# EAGLE design Stick IMUinator v1.3 (EAGLE 6.2)
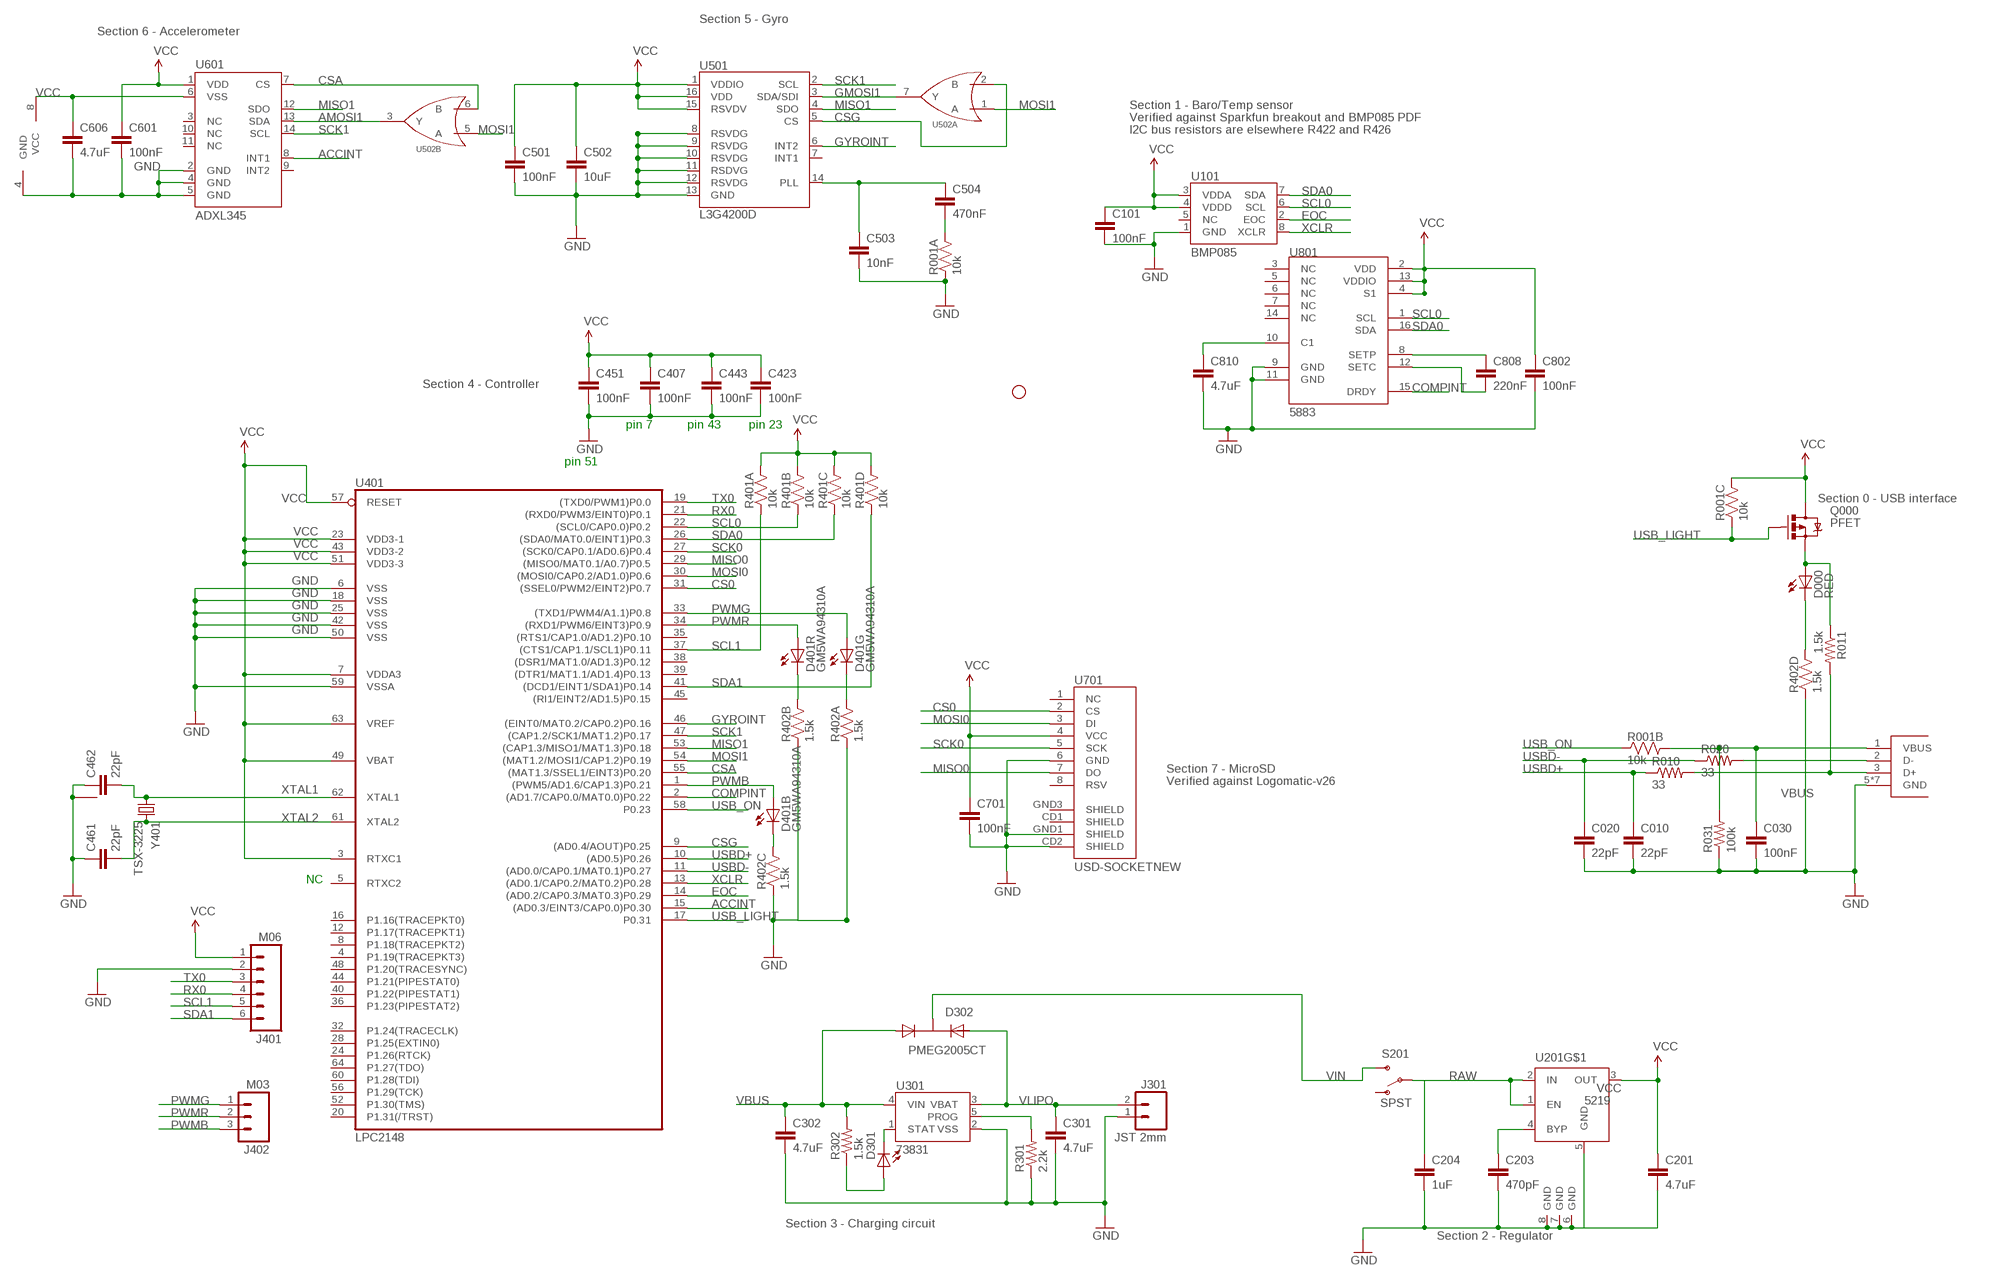
[diagram p0: schematic, sheet 1]

## Parts
C010  22pF  CAP0402-CAP  [0402-CAP]
C020  22pF  CAP0402-CAP  [0402-CAP]
C030  100nF  CAP0402-CAP  [0402-CAP]
C101  100nF  CAP0402-CAP  [0402-CAP]
C201  4.7uF  CAP0402-CAP  [0402-CAP]
C203  470pF  CAP0402-CAP  [0402-CAP]
C204  1uF  CAP0402-CAP  [0402-CAP]
C301  4.7uF  CAP0402-CAP  [0402-CAP]
C302  4.7uF  CAP0402-CAP  [0402-CAP]
C407  100nF  CAP0402-CAP  [0402-CAP]
C423  100nF  CAP0402-CAP  [0402-CAP]
C443  100nF  CAP0402-CAP  [0402-CAP]
C451  100nF  CAP0402-CAP  [0402-CAP]
C461  22pF  CAP0402-CAP  [0402-CAP]
C462  22pF  CAP0402-CAP  [0402-CAP]
C501  100nF  CAP0402-CAP  [0402-CAP]
C502  10uF  CAP0603-CAP  [0603-CAP]
C503  10nF  CAP0402-CAP  [0402-CAP]
C504  470nF  CAP0402-CAP  [0402-CAP]
C601  100nF  CAP0402-CAP  [0402-CAP]
C606  4.7uF  CAP0402-CAP  [0402-CAP]
C701  100nF  CAP0402-CAP  [0402-CAP]
C802  100nF  CAP0402-CAP  [0402-CAP]
C808  220nF  CAP0402-CAP  [0402-CAP]
C810  4.7uF  CAP0402-CAP  [0402-CAP]
D000  RED  LED0603  [LED-0603]
D301  RED  LED0603  [LED-0603]
D302  PMEG2005CT  [SOT-23-3]
D401  GM5WA94310A  [GM5WA94310A]
J301  JST 2mm  M02-JST-2MM-SMT  [JST-2-SMD]
J401  M06  M06LOCK  [1X06_LOCK]
J402  M03  M03LOCK  [1X03_LOCK]
JP1  STAND-OFF  [STAND-OFF]
Q000  PFET  MOSFET-PCHANNELSMD  [SOT23-3]
R001  10k  RP404  [CRA04]
R010  33  RESISTOR0402-RES  [0402-RES]
R011  1.5k  RESISTOR0402-RES  [0402-RES]
R020  33  RESISTOR0402-RES  [0402-RES]
R031  100k  RESISTOR0402-RES  [0402-RES]
R301  2.2k  RESISTOR0402-RES  [0402-RES]
R302  1.5k  RESISTOR0402-RES  [0402-RES]
R401  10k  RP404  [CRA04]
R402  1.5k  RP404  [CRA04]
S201  SPST  SWITCH-SPSTSMD  [AYZ0202]
U101  BMP085  [BMP085]
U201  5219  MIC5219FMM  [MSOP08]
U301  73831  MCP73831  [SOT23-5]
U401  LPC2148  LPC213X  [SQFP-S-10X10-64]
U501  L3G4200D  [LGA16-4X4]
U502  SN74LVC2G32  [DCU_8]
U601  ADXL345  [LGA14]
U701  USD-SOCKETNEW  [MICRO-SD-SOCKET-PP]
U801  5883  HMC5883LSMD  [16LPCC]
U$1  USB_MICROB_JST  [UB-MC5BR3-SD204-4S]
Y401  TSX-3225  [CRYSTAL_SMD]

## Nets
ACCINT: U401.15((AD0.3/EINT3/CAP0.0)P0.30) U601.8(INT1)
AMOSI1: U502.3(B:Y) U601.13(SDA)
COMPINT: U401.2((AD1.7/CAP0.0/MAT0.0)P0.22) U801.15(DRDY)
CONN_D+: R010.2 R011.2 U$1.3(D+)
CONN_D-: R020.2 U$1.2(D-)
CS0: U401.31((SSEL0/PWM2/EINT2)P0.7) U701.2(CS)
CSA: U401.55((MAT1.3/SSEL1/EINT3)P0.20) U502.6(B:B) U601.7(CS)
CSG: U401.9((AD0.4/AOUT)P0.25) U501.5(CS) U502.2(A:B)
EOC: U101.2(EOC) U401.14((AD0.2/CAP0.3/MAT0.3)P0.29)
GMOSI1: U501.3(SDA/SDI) U502.7(A:Y)
GND [power]: C010.2 C020.2 C030.2 C101.2 C201.2 C203.2 C204.2 C301.2 C302.2 C407.2 C423.2 C443.2 C451.2 C461.1 C462.1 C501.2 C502.2 C503.2 C601.2 C606.2 C701.2 C802.2 C810.2 J301.1 J401.2 R001.1 R031.1 R301.1 R402.1 R402.2 R402.3 R402.4 U101.1(GND) U201.5(GND) U201.6(GND) U201.7(GND) U201.8(GND) U301.2(VSS) U401.6(VSS) U401.18(VSS) U401.25(VSS) U401.42(VSS) U401.50(VSS) U401.59(VSSA) U501.8(RSVDG) U501.9(RSVDG) U501.10(RSVDG) U501.11(RSDVG) U501.12(RSVDG) U501.13(GND) U502.4(PWR:GND) U601.2(GND) U601.4(GND) U601.5(GND) U701.6(GND) U701.CD2(SHIELD) U701.GND1(SHIELD) U801.9(GND) U801.11(GND) U$1.5(GND) U$1.P$6(GND) U$1.P$7(GND) U$1.P$8(GND) U$1.P$9(GND) U$1.P$10(GND) U$1.P$11(GND) Y401.2 Y401.4
GYROINT: U401.46((EINT0/MAT0.2/CAP0.2)P0.16) U501.6(INT2)
MISO0: U401.29((MISO0/MAT0.1/A0.7)P0.5) U701.7(DO)
MISO1: U401.53((CAP1.3/MISO1/MAT1.3)P0.18) U501.4(SDO) U601.12(SDO)
MOSI0: U401.30((MOSI0/CAP0.2/AD1.0)P0.6) U701.3(DI)
MOSI1: U401.54((MAT1.2/MOSI1/CAP1.2)P0.19) U502.1(A:A) U502.5(B:A)
N$1: C504.2 R001.8
N$2: R301.2 U301.5(PROG)
N$4: D301.C U301.1(STAT)
N$5: D301.A R302.1
N$6: D000.A Q000.2(S) R011.1
N$7: D000.C R402.5
N$11: D401.5(R:C) R402.7
N$12: D401.6(B:C) R402.6
N$13: D401.4(G:C) R402.8
N$14: C808.1 U801.8(SETP)
N$15: C808.2 U801.12(SETC)
N$16: C810.1 U801.10(C1)
N$17: C203.1 U201.4(BYP)
N$20: C503.1 C504.1 U501.14(PLL)
PWMB: D401.1(B:A) J402.3 U401.1((PWM5/AD1.6/CAP1.3)P0.21)
PWMG: D401.3(G:A) J402.1 U401.33((TXD1/PWM4/A1.1)P0.8)
PWMR: D401.2(R:A) J402.2 U401.34((RXD1/PWM6/EINT3)P0.9)
RAW: C204.1 S201.2(P) U201.1(EN) U201.2(IN)
RX0: J401.4 U401.21((RXD0/PWM3/EINT0)P0.1)
SCK0: U401.27((SCK0/CAP0.1/AD0.6)P0.4) U701.5(SCK)
SCK1: U401.47((CAP1.2/SCK1/MAT1.2)P0.17) U501.2(SCL) U601.14(SCL)
SCL0: R401.2 U101.6(SCL) U401.22((SCL0/CAP0.0)P0.2) U801.1(SCL)
SCL1: J401.5 R401.1 U401.37((CTS1/CAP1.1/SCL1)P0.11)
SDA0: R401.3 U101.7(SDA) U401.26((SDA0/MAT0.0/EINT1)P0.3) U801.16(SDA)
SDA1: J401.6 R401.4 U401.41((DCD1/EINT1/SDA1)P0.14)
TX0: J401.3 U401.19((TXD0/PWM1)P0.0)
USB_LIGHT: Q000.1(G) R001.3 U401.17(P0.31)
USB_ON: R001.2 U401.58(P0.23)
USBD+: C010.1 R010.1 U401.10((AD0.5)P0.26)
USBD-: C020.1 R020.1 U401.11((AD0.0/CAP0.1/MAT0.1)P0.27)
VBUS: C030.1 C302.1 D302.1(A1) R001.7 R031.2 R302.2 U301.4(VIN) U$1.1(VBUS)
VCC [power]: C101.1 C201.1 C407.1 C423.1 C443.1 C451.1 C501.1 C502.1 C601.1 C606.1 C701.1 C802.1 J401.1 Q000.3(D) R001.6 R401.5 R401.6 R401.7 R401.8 U101.3(VDDA) U101.4(VDDD) U201.3(OUT) U401.3(RTXC1) U401.7(VDDA3) U401.23(VDD3-1) U401.43(VDD3-2) U401.49(VBAT) U401.51(VDD3-3) U401.57(RESET) U401.63(VREF) U501.1(VDDIO) U501.15(RSVDV) U501.16(VDD) U502.8(PWR:VCC) U601.1(VDD) U601.6(VSS) U701.4(VCC) U801.2(VDD) U801.4(S1) U801.13(VDDIO)
VIN: D302.3(K) S201.3(S)
VLIPO: C301.1 D302.2(A2) J301.2 U301.3(VBAT)
XCLR: U101.8(XCLR) U401.13((AD0.1/CAP0.2/MAT0.2)P0.28)
XTAL1: C462.2 U401.62(XTAL1) Y401.1
XTAL2: C461.2 U401.61(XTAL2) Y401.3
Unconnected: R001.4 R001.5 S201.1(O) U101.5(NC) U401.4(P1.19(TRACEPKT3)) U401.5(RTXC2) U401.8(P1.18(TRACEPKT2)) U401.12(P1.17(TRACEPKT1)) U401.16(P1.16(TRACEPKT0)) U401.20(P1.31(/TRST)) U401.24(P1.26(RTCK)) U401.28(P1.25(EXTIN0)) U401.32(P1.24(TRACECLK)) U401.35((RTS1/CAP1.0/AD1.2)P0.10) U401.36(P1.23(PIPESTAT2)) U401.38((DSR1/MAT1.0/AD1.3)P0.12) U401.39((DTR1/MAT1.1/AD1.4)P0.13) U401.40(P1.22(PIPESTAT1)) U401.44(P1.21(PIPESTAT0)) U401.45((RI1/EINT2/AD1.5)P0.15) U401.48(P1.20(TRACESYNC)) U401.52(P1.30(TMS)) U401.56(P1.29(TCK)) U401.60(P1.28(TDI)) U401.64(P1.27(TDO)) U501.7(INT1) U601.3(NC) U601.9(INT2) U601.10(NC) U601.11(NC) U701.1(NC) U701.8(RSV) U701.CD1(SHIELD) U701.GND3(SHIELD) U801.3(NC) U801.5(NC) U801.6(NC) U801.7(NC) U801.14(NC)

## Notes on the sheet
- Section 5 - Gyro
- Section 6 - Accelerometer
- Section 1 - Baro/Temp sensor
- Verified against Sparkfun breakout and BMP085 PDF
- I2C bus resistors are elsewhere R422 and R426
- Section 4 - Controller
- pin 7 | pin 43 | pin 23
- pin 51
- Section 0 - USB interface
- Section 7 - MicroSD
- Verified against Logomatic-v26
- NC
- Section 3 - Charging circuit
- Section 2 - Regulator

## Library data of the parts
C010 C020 C030 C101 C201 C203 C204 C301 C302 C407 C423 C443 C451 C461 C462 C501-C504 C601 C606 C701 C802 C808 C810 = SparkFun:CAP: Capacitor Standard 0603 ceramic capacitor, and 0.1" leaded capacitor.
D000 D301 = SparkFun:LED: LEDs Standard schematic elements and footprints for 5mm, 3mm, 1206, and 0603 sized LEDs. 5mm - Spark Fun Electronics SKU : COM-00529 (and others)
D302 = KwanSystems:PMEG2005CT
D401 = led:GM5WA94310A: Chip LED RGB Source: http://document.sharpsma.com/files/GM5WA94310A_SS.pdf
J301 = SparkFun:M02: Header 2 Standard 2-pin 0.1" header. Use with straight break away headers (SKU : PRT-00116), right angle break away headers (PRT-00553), swiss pins (PRT-00743), machine pins (PRT-00117), and female headers (PRT-00115). Molex polarized connector foot print use with SKU : PRT-08233 with associated crimp pins and housings.
J401 = SparkFun:M06: Header 6 Standard 6-pin 0.1" header. Use with straight break away headers (SKU : PRT-00116), right angle break away headers (PRT-00553), swiss pins (PRT-00743), machine pins (PRT-00117), and female headers (PRT-00115). Molex polarized connector foot print use with SKU : PRT-08094 with associated crimp pins and housings. NOTES ON THE VARIANTS LOCK and LOCK_LONGPADS... This footprint was designed to help hold the alignment of a through-hole component (i.e. 6-pin header) while soldering it into place. You may notice that each hole has been shifted either up or down by 0.005 of an inch from it's more standard position (which is a perfectly straight line). This slight alteration caused the pins (the squares in the middle) to touch the edges of the holes. Because they are alternating, it causes a "brace" to hold the component in place. 0.005 has proven to be the perfect amount of "off-center" position when using our standard breakaway headers. Although looks a little odd when you look at the bare footprint, once you have a header in there, the alteration is very hard to notice. Also, if you push a header all the way into place, it is covered up entirely on the bottom side. This idea of altering the position of holes to aid alignment will be further integrated into the Sparkfun Library for other footprints. It can help hold any component with 3 or more connection pins.
J402 = SparkFun:M03: Header 3 Standard 3-pin 0.1" header. Use with straight break away headers (SKU : PRT-00116), right angle break away headers (PRT-00553), swiss pins (PRT-00743), machine pins (PRT-00117), and female headers (PRT-00115). Molex polarized connector foot print use with SKU : PRT-08232 with associated crimp pins and housings.
JP1 = SparkFun:STAND-OFF: Stand Off This is the mechanical footprint for a #4 phillips button head screw. Use the keepout ring to avoid running the screw head into surrounding components. SKU : PRT-00447
Q000 = SparkFun:MOSFET-PCHANNEL
R001 R401 R402 = KwanSystems:RP4
R010 R011 R020 R031 R301 R302 = SparkFun:RESISTOR: Resistor Basic schematic elements and footprints for 0603, 1206, and PTH resistors.
S201 = SparkFun:SWITCH-SPST: SPST Switch Simple slide switch. Spark Fun Electronics SKU : COM-00102
U101 = SparkFun:BMP085: BMP085 Pressure Sensor Great little MEMS pressure sensor. SKU: COM-09603
U201 = v-reg-micrel:MIC5219FMM: VOLTAGE REGULATOR; OC_FARNELL: unknown; OC_NEWARK: unknown
U301 = SparkFun:MCP73831: Microchip's MCP73831 Miniature single cell, fully integrated Li-Ion, Li-polymer charge management controller http://ww1.microchip.com/downloads/en/DeviceDoc/21984a.pdf
U401 = SparkFun:LPC213X: LPC213x Schematic element and footprint for NXP LPC213x. Spark Fun Electronics SKU : COM-00520
U501 = SparkFun:L3G4200D: L3G4200D Three-axis, digital output gyroscope The L3G4200D is a low-power three-axis angular rate sensor, has a full scale of ±250/±500/±2000 dps and is capable of measuring rates with a user-selectable bandwidth. It includes a sensing element and an IC interface capable of providing the measured angular rate to the external world through a digital interface (I2C/SPI). Package: 4x4x1.1 LGA-16 (LGA16-4x4.PAC)
U502 = KwanSystems:SN74LVC2G32; DIGIKEY: 296-13268-1-ND
U601 = SparkFun:ADXL345
U701 = SparkFun:USD-SOCKET: microSD Socket Push-push type uSD socket. Schematic element and footprint production proven. Spark Fun Electronics SKU : PRT-00127. tDoc lines correctly indicate media card edge positions when inserting (unlocked, locked, depressed).
U801 = SparkFun:HMC5883L: 3 Axis Digital Compass IC
U$1 = KwanSystems:USB_MICROB_JST
Y401 = KwanSystems:TSX-3225

## Net classes
0 default: width 0.152 mm, drill 0.33 mm, clearance 0.152 mm
1 power: width 0.152 mm, drill 0.33 mm, clearance 0.152 mm to class 0, clearance 0.152 mm
2 hv: width 0.152 mm, drill 0.33 mm, clearance 0.152 mm to class 0, clearance 0.152 mm to class 1, clearance 0.152 mm

## Board
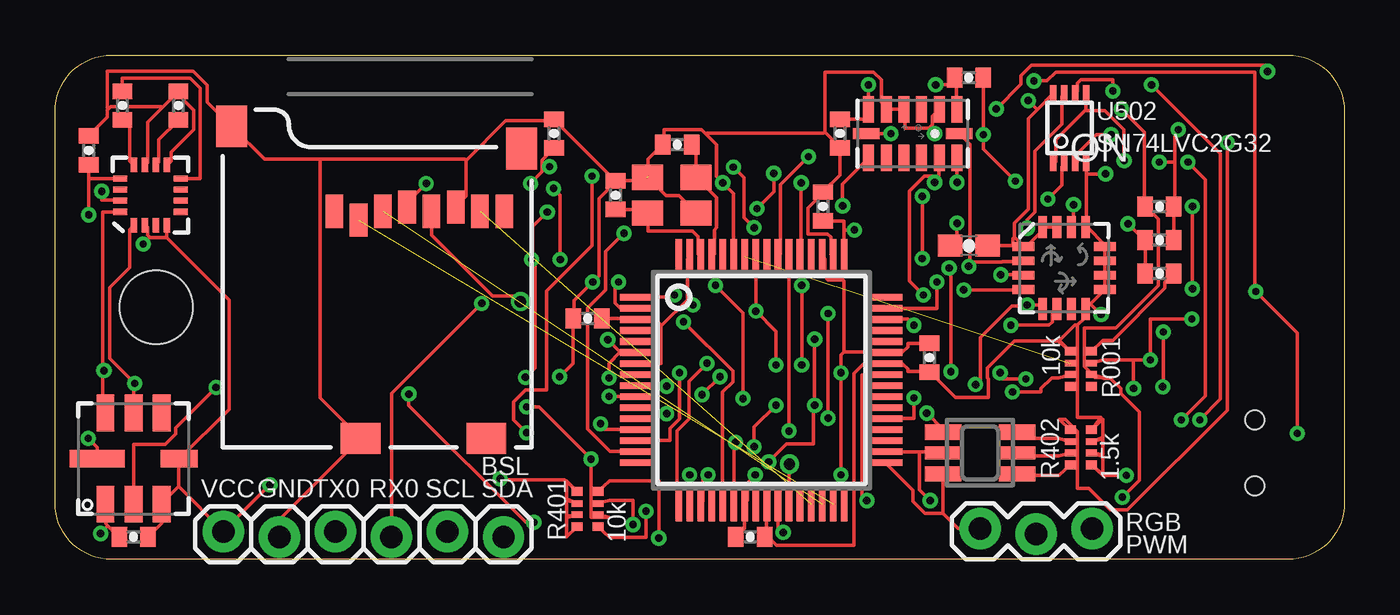
[diagram p1: board, top side]
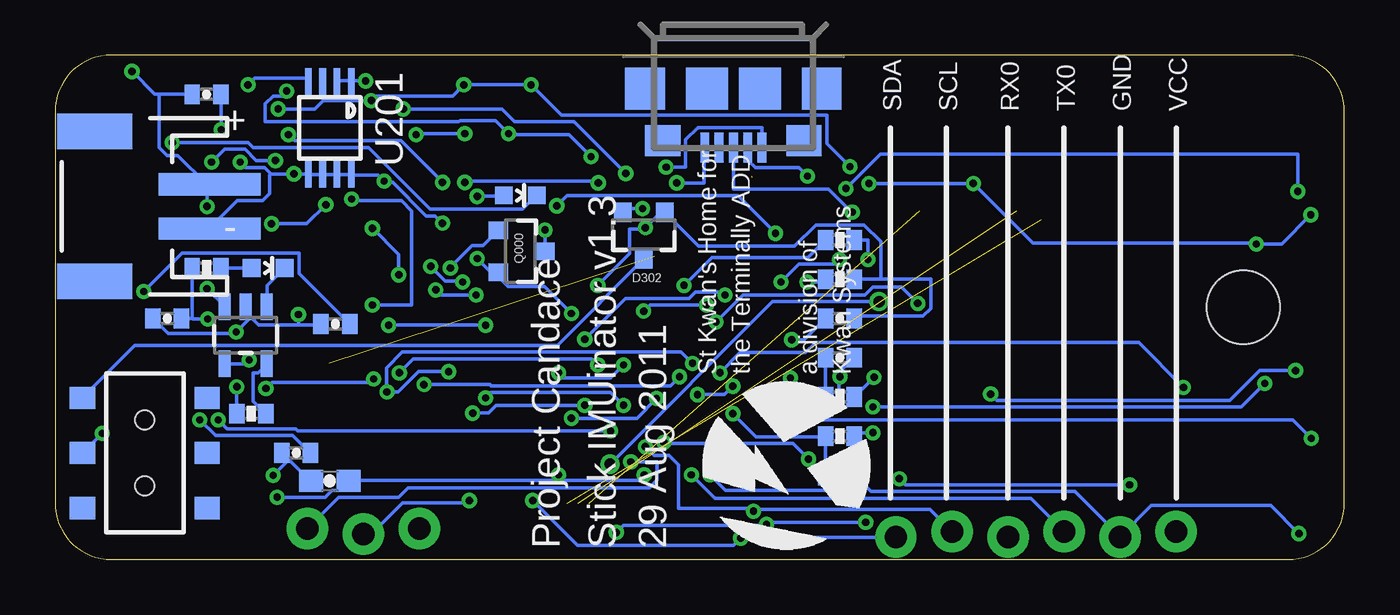
[diagram p2: board, bottom side, seen from below]

Size 58.42 x 22.86 mm. Coordinates in mm from the lower left corner, seen from the top.
Outline: 2.54,22.86 55.88,22.86 arc-90 58.42,20.32 58.42,2.54 arc-90 55.88,0 2.54,0 arc-90 0,2.54 0,20.32 arc-90 2.54,22.86
Copper layers (1*16): Top 0.0356mm / dielectric 1.5011mm / Bottom 0.0356mm
Design rules: minimum track width 6mil, minimum drill 13mil, track to track 6mil, track to pad 6mil, pad to pad 6mil, via to via 6mil, smd to smd 6mil, copper to edge 15mil, drill to drill 6mil, minimum pad ring 7mil, minimum via ring 7mil, stop-mask expansion 4mil, vias tented up to drill 0mil, thermal gap 10mil
tRestrict: area 2.5,17.5 to 3.3,18.3; area 5.3,17.5 to 6.1,18.3; area 3.3,15.5 to 5.3,17.5; area 2.5,14.7 to 3.3,15.5; area 5.3,14.7 to 6.1,15.5; area 41.1,3.3 to 42.7,6.3; area 44.5,11.9 to 47,14.5
bRestrict: area 2.5,14.7 to 6.1,18.3; area 36.8,12.4 to 37.8,15.5
vRestrict: area 44.5,18 to 47.5,21.1

### Footprints (pad centres in the part's own frame; a part is rotated, then mirrored left to right if it is on the bottom)
0402-CAP = smd 0.7 x 0.9: 1 -0.65,0; 2 0.65,0
0603-CAP = smd 1.1 x 1: 1 -0.85,0; 2 0.85,0
LED-0603 = smd 0.8 x 0.8: A 0,-0.75; C 0,0.75
SOT-23-3 = smd 0.9 x 0.8: 1 -1,0.95; 2 -1,-0.95; 3 1.1,0
GM5WA94310A = smd 0.7 x 1.65: 1 -0.95,-1.675; 3 0.95,-1.675; 4 0.95,1.675; 6 -0.95,1.675 | smd 0.6 x 1.65: 2 0,-1.675; 5 0,1.675
JST-2-SMD = smd 1 x 4.6: 1 -1,-3.7; 2 1,-3.7 | smd 1.6 x 3.4: NC1 -3.4,1.5; NC2 3.4,1.5
1X06_LOCK = drill 1.016 pad 1.88: 1 0,0; 2 2.54,-0.254; 3 5.08,0; 4 7.62,-0.254; 5 10.16,0; 6 12.7,-0.254
1X03_LOCK = drill 1.016 pad 1.88: 1 0,0.127; 2 2.54,-0.127; 3 5.08,0.127
STAND-OFF = hole 3.302: 0,0
SOT23-3 = smd 0.8 x 0.9: 1 -0.95,-1; 2 0.95,-1; 3 0,1.1
CRA04 = smd 0.4 x 0.5: 1 -0.8,-0.475; 4 0.8,-0.475; 5 0.8,0.475; 8 -0.8,0.475 | smd 0.3 x 0.5: 2 -0.25,-0.475; 3 0.25,-0.475; 6 0.25,0.475; 7 -0.25,0.475
0402-RES = smd 0.7 x 0.9: 1 -0.65,0; 2 0.65,0
AYZ0202 = smd 1 x 1.15: 1 -2.5,2.825; 2 0,2.825; 3 2.5,2.825; 4 -2.5,-2.825; 5 0,-2.825; 6 2.5,-2.825 | hole 0.85: 1.5,0; -1.5,0
BMP085 = smd 1.67 x 0.8: 1 -2.065,1.27; 2 -2.065,0; 3 -2.065,-1.27; 5 2.065,-1.27; 6 2.065,0; 7 2.065,1.27 | smd 0.8 x 1.67: 4 0,-2.065 | smd 0.8 x 2.5: 8 0,1.65
MSOP08 = smd 0.3 x 1.2: 1 -0.976,-2.113; 2 -0.326,-2.113; 3 0.324,-2.113; 4 0.974,-2.113; 5 0.974,2.112; 6 0.324,2.112; 7 -0.326,2.112; 8 -0.976,2.112
SOT23-5 = smd 0.55 x 1.2: 1 -0.95,-1.3; 2 0,-1.3; 3 0.95,-1.3; 4 0.95,1.3; 5 -0.95,1.3
SQFP-S-10X10-64 = smd 0.3 x 1.6: 1 -3.75,-5.6; 2 -3.25,-5.6; 3 -2.75,-5.6; 4 -2.25,-5.6; 5 -1.75,-5.6; 6 -1.25,-5.6; 7 -0.75,-5.6; 8 -0.25,-5.6; 9 0.25,-5.6; 10 0.75,-5.6; 11 1.25,-5.6; 12 1.75,-5.6; 13 2.25,-5.6; 14 2.75,-5.6; 15 3.25,-5.6; 16 3.75,-5.6; 33 3.75,5.6; 34 3.25,5.6; 35 2.75,5.6; 36 2.25,5.6; 37 1.75,5.6; 38 1.25,5.6; 39 0.75,5.6; 40 0.25,5.6; 41 -0.25,5.6; 42 -0.75,5.6; 43 -1.25,5.6; 44 -1.75,5.6; 45 -2.25,5.6; 46 -2.75,5.6; 47 -3.25,5.6; 48 -3.75,5.6 | smd 1.6 x 0.3: 17 5.6,-3.75; 18 5.6,-3.25; 19 5.6,-2.75; 20 5.6,-2.25; 21 5.6,-1.75; 22 5.6,-1.25; 23 5.6,-0.75; 24 5.6,-0.25; 25 5.6,0.25; 26 5.6,0.75; 27 5.6,1.25; 28 5.6,1.75; 29 5.6,2.25; 30 5.6,2.75; 31 5.6,3.25; 32 5.6,3.75; 49 -5.6,3.75; 50 -5.6,3.25; 51 -5.6,2.75; 52 -5.6,2.25; 53 -5.6,1.75; 54 -5.6,1.25; 55 -5.6,0.75; 56 -5.6,0.25; 57 -5.6,-0.25; 58 -5.6,-0.75; 59 -5.6,-1.25; 60 -5.6,-1.75; 61 -5.6,-2.25; 62 -5.6,-2.75; 63 -5.6,-3.25; 64 -5.6,-3.75
LGA16-4X4 = smd 1 x 0.4: 1 -1.85,0.975; 2 -1.85,0.325; 3 -1.85,-0.325; 4 -1.85,-0.975; 9 1.85,-0.975; 10 1.85,-0.325; 11 1.85,0.325; 12 1.85,0.975 | smd 0.4 x 1: 5 -0.975,-1.85; 6 -0.325,-1.85; 7 0.325,-1.85; 8 0.975,-1.85; 13 0.975,1.85; 14 0.325,1.85; 15 -0.325,1.85; 16 -0.975,1.85
DCU_8 = smd 0.3 x 0.8: 1 -0.75,-1.55; 2 -0.25,-1.55; 3 0.25,-1.55; 4 0.75,-1.55; 5 0.75,1.55; 6 0.25,1.55; 7 -0.25,1.55; 8 -0.75,1.55
LGA14 = smd 0.5 x 1.2: 1 2,1.1; 2 1.2,1.1; 3 0.4,1.1; 4 -0.4,1.1; 5 -1.2,1.1; 6 -2,1.1; 8 -2,-1.1; 9 -1.2,-1.1; 10 -0.4,-1.1; 11 0.4,-1.1; 12 1.2,-1.1; 13 2,-1.1 | smd 1.2 x 0.5: 7 -2.1,0; 14 2.1,0
MICRO-SD-SOCKET-PP = smd 0.8 x 1.5: 1 -8.94,10.7; 2 -7.84,10.3; 3 -6.74,10.7; 4 -5.64,10.9; 5 -4.54,10.7; 6 -3.44,10.9; 7 -2.34,10.7; 8 -1.24,10.7 | smd 1.8 x 1.4: CD1 -2.05,0.4; CD2 -7.75,0.4 | smd 1.4 x 1.9: GND1 -13.6,14.55; GND3 -0.45,13.55
16LPCC = smd 0.65 x 0.28: 1 -1.37,0.75; 2 -1.37,0.25; 3 -1.37,-0.25; 4 -1.37,-0.75; 9 1.37,-0.75; 10 1.37,-0.25; 11 1.37,0.25; 12 1.37,0.75 | smd 0.28 x 0.65: 5 -0.75,-1.37; 6 -0.25,-1.37; 7 0.25,-1.37; 8 0.75,-1.37; 13 0.75,1.37; 14 0.25,1.37; 15 -0.25,1.37; 16 -0.75,1.37
UB-MC5BR3-SD204-4S = smd 0.4 x 1.35: 1 -1.3,2.675; 2 -0.65,2.675; 3 0,2.675; 4 0.65,2.675; 5 1.3,2.675 | smd 1.8 x 1.9: P$6 4,0; P$7 -4,0 | smd 1.9 x 1.9: P$8 -1.2,0; P$9 1.2,0 | smd 1.6 x 1.4: P$10 -3.2,2.35; P$11 3.2,2.35
CRYSTAL_SMD = smd 1.4 x 1.15: 1 -1.092,-0.813; 2 1.092,-0.813; 3 1.092,0.813; 4 -1.092,0.813

### Placement (x,y rotation side)
C010  22.86,9.14 0 bottom
C020  22.86,3.81 0 bottom
C030  22.86,10.92 180 bottom
C101  3.56,1.02 180 top
C201  4.7uF  [0603-CAP]  45.97,3.56 180 bottom
C203  47.5,4.83 180 bottom
C204  45.72,10.67 180 bottom
C301  51.56,21.08 0 bottom
C302  53.34,10.92 180 bottom
C407  24.13,10.92 180 top
C423  31.5,1.02 0 top
C443  39.62,9.14 270 top
C451  34.8,16 90 top
C461  28.19,18.8 0 top
C462  25.4,16.51 270 top
C501  50.04,16 0 top
C502  41.4,14.22 180 top
C503  50.04,14.48 0 top
C504  50.04,12.95 0 top
C601  41.4,21.84 0 top
C606  35.56,19.3 270 top
C701  22.61,19.3 90 top
C802  1.52,18.54 90 top
C808  3.05,20.57 270 top
C810  5.59,20.57 90 top
D000  37.34,16.51 270 bottom
D301  48.77,13.21 270 bottom
D302  31.75,14.73 270 bottom
D401  41.91,4.83 270 top
J301  55.12,16 90 bottom
J401  7.62,1.27 0 top
J402  41.91,1.27 0 top
JP1  4.57,11.43 0 top
Q000  37.34,13.97 270 bottom
R001  46.48,8.64 270 top
R010  22.86,7.37 0 bottom
R011  22.86,14.48 0 bottom
R020  22.86,5.59 0 bottom
R031  22.86,12.7 0 bottom
R301  49.53,6.6 0 bottom
R302  51.56,13.21 180 bottom
R401  24.13,2.29 90 top
R402  46.48,5.08 90 top
S201  54.36,4.83 90 bottom
U101  3.56,4.57 90 top
U201  45.97,19.56 180 bottom
U301  49.78,10.16 180 bottom
U401  32,8.13 270 top
U501  45.72,13.21 0 top
U502  45.97,19.56 0 top
U601  38.86,19.3 0 top
U701  21.59,5.08 0 top
U801  4.32,16.51 90 top
U$1  27.69,21.34 180 bottom
Y401  27.94,16.51 0 top

### Tracks (layer width: path | path; a pad name or v marks a point on that pad's centre or on a via)
ACCINT  (via drill 0.33)
  Top 0.152: v35.69,16.03 35.69,17.02 36.85,18.19 U601.8 | v25.78,14.78 24.94,13.95 24.94,12.22 24.13,11.4 24.13,5.92 25.15,4.9 26.39,4.9 U401.15
  Bottom 0.152: v35.69,16.03 35.23,16.48 27.48,16.48 v25.78,14.78
AMOSI1  (via drill 0.33)
  Top 0.152: v47.85,19.25 47.19,19.25 46.33,18.39 46.33,18.03 46.23,17.93 U502.3 | v40.87,17.09 40.87,18.19 U601.13
  Bottom 0.152: v47.85,19.25 47.57,18.97 42.75,18.97 v40.87,17.09
COMPINT  (via drill 0.33)
  Top 0.152: v2.11,16.69 2.11,16.28 2.95,16.28 U801.15 | v22.58,16.82 22.89,16.51 v22.89,13.59 | v25.53,12.57 25.38,12.42 25.38,11.63 25.63,11.38 U401.2
  Bottom 0.152: v2.11,16.69 2.11,18.36 21.03,18.36 v22.58,16.82 | v22.89,13.59 23.09,13.39 24.71,13.39 v25.53,12.57
CONN_D+  (via drill 0.33)
  Top 0.152: v21.31,8.26 21.74,8.69 21.74,13.44 v21.59,13.59 21.64,13.64 21.64,15.09 v22.3,15.75
  Bottom 0.152: v21.31,8.26 R010.2 | v21.59,13.59 21.59,14.48 R011.2 | v22.3,15.75 22.33,15.75 23.37,16.79 27.69,16.79 U$1.3
CONN_D-  (via drill 0.33)
  Top 0.152: v21.36,5.74 20.78,6.33 20.78,7.14 21.31,7.67 22.28,7.67 22.28,12.17 24.33,14.22 v24.33,17.37
  Bottom 0.152: v21.36,5.74 22.05,5.74 R020.2 | v24.33,17.37 24.71,17.75 26.7,17.75 27.03,18.09 27.03,18.64 U$1.2
CS0  (1 unrouted)
CSA  (via drill 0.33)
  Top 0.152: v47.93,21.23 47.93,21.74 46.48,21.74 46.33,21.59 46.33,21.23 46.23,21.13 U502.6 | v37.87,19.3 U601.7 | v34.14,18.26 32.87,16.99 32.87,13.84 32.77,13.74 U401.55
  Bottom 0.152: v47.93,21.23 48.16,21.01 48.54,21.01 48.9,20.65 48.9,19.84 40.13,19.84 40.08,19.89 38.46,19.89 v37.87,19.3 37.82,19.25 35.13,19.25 v34.14,18.26
CSG  (via drill 0.33)
  Top 0.152: v44.98,16.33 45.62,16.97 45.62,17.8 45.72,17.91 U502.2 | U501.5 44.73,11.38 44.73,11.53 v44.04,11.53 43.99,11.48 43.36,11.48 41.94,10.06 41.94,8.15 v41.71,7.92 | v27.71,7.85 27.71,7.87 26.42,7.87 U401.9 | v29.31,7.47 v30.12,8.28
  Bottom 0.152: v44.98,16.33 44.91,16.26 42.72,16.26 42.27,15.8 42.27,11.53 v44.04,11.53 | v27.71,7.85 28.09,7.47 v29.31,7.47 | v30.12,8.28 30.53,7.87 38.66,7.87 38.71,7.92 v41.71,7.92
EOC  (via drill 0.33)
  Top 0.152: v28.3,8.46 28.3,6.38 27.86,5.94 27.86,5.38 26.42,5.38 U401.14 | v7.29,7.8 5.46,5.97 5.46,5.69 4.98,5.21 3.56,5.21 U101.2
  Bottom 0.152: v28.3,8.46 27.38,9.37 24.41,9.37 23.95,9.83 9.32,9.83 v7.29,7.8
GMOSI1  (via drill 0.33)
  Top 0.152: v44.04,15.01 44.04,15.39 44.4,15.75 44.4,18.52 45.62,19.74 45.62,21.01 U502.7 | v42.85,12.9 43.87,12.9 U501.3
  Bottom 0.152: v44.04,15.01 42.85,13.82 v42.85,12.9
GND  (via drill 0.33)  (2 unrouted)
  Top 0.152: C503.2 C501.2 50.75,16.05 50.75,18.01 | v50.9,19.48 50.75,19.33 50.75,18.01 | v43.51,17.14 42.06,18.59 v42.06,19.25 42.06,21.84 C601.2 | v40.87,15.24 40.87,14.53 40.56,14.22 C502.2 | v50.04,18.01 50.75,18.01 | U401.25 32.23,2.52 32.23,1.09 C423.2 32.28,1.04 32.69,0.64 36.2,0.64 36.2,8.43 36.6,8.84 37.54,8.84 U401.42 37.62,8.87 38.41,8.87 38.63,8.64 38.63,8.51 39.62,8.51 C443.2 39.67,8.46 40.79,7.34 42.29,7.34 42.29,8.18 42.24,8.23 42.24,8.69 43.46,9.91 45.44,9.91 R001.1 45.52,9.93 46.2,10.62 46.33,10.62 | v50.19,7.82 50.22,7.85 v50.22,10.31 | v48.54,3.81 47.55,3.81 R402.1 47.47,3.81 47.47,4.67 R402.2 47.47,4.75 47.47,5.46 R402.3 47.47,5.54 47.47,6.35 R402.4 47.4,6.43 46.33,6.43 46.33,10.62 | 46.74,17.48 46.74,15.09 U501.13 46.79,15.04 47.55,14.28 47.55,14.25 U501.12 47.57,13.59 U501.11 47.57,13.51 47.57,12.95 U501.10 47.57,12.29 U501.9 47.55,12.22 46.91,11.58 | 46.74,17.48 46.74,17.91 U502.4 | 46.91,11.58 46.71,11.38 U501.8 46.66,11.3 46.66,10.95 46.33,10.62 | 46.91,11.58 v47.4,11.1 | v47.6,17.48 46.74,17.48 | 2.39,1.52 2.29,1.63 U101.1 | 2.39,1.52 2.9,1.02 C101.2 | v28.75,3.83 U401.18 | J401.2 10.16,1.8 13.82,5.46 U701.CD2 13.79,5.54 12.01,7.32 12.01,18.14 | v2.06,1.17 2.06,1.19 2.39,1.52 | 39.6,19.56 39.75,19.71 39.75,20.09 U601.2 | 39.6,19.56 38.51,19.56 38.51,20.34 U601.4 38.46,20.42 37.67,20.42 U601.5 37.67,20.5 37.44,20.73 37.44,21.74 37.08,22.1 34.87,22.1 34.87,19.38 | U401.50 35.23,13.74 35.15,13.82 35.15,14.61 35,14.76 34.11,14.76 34.11,15.93 34.77,16.59 C451.2 34.8,16.66 35.56,17.42 C606.2 35.53,18.72 34.87,19.38 | 4.85,20.47 5.59,21.21 C810.2 5.56,21.08 6.27,20.37 6.27,19.48 5.26,18.47 5.26,18.06 U801.9
  Top 0.152: 4.85,20.47 4.19,19.81 4.19,17.98 4.09,17.88 U801.11 | 2.41,20.42 2.52,20.52 4.8,20.52 4.85,20.47 | 2.41,20.42 2.36,20.37 2.36,20.04 1.52,19.2 C802.2 | 2.41,20.42 2.36,20.47 2.36,22.12 6.25,22.12 6.88,21.49 6.88,20.73 7.98,19.63 U701.GND1 8.05,19.58 9.5,18.14 12.01,18.14 | 25.6,9.4 v25.04,9.96 | 25.6,9.4 26.39,9.4 U401.6 | v22.86,8.28 23.47,8.89 C407.2 23.52,10.97 23.52,11.73 v24.36,12.57 24.64,12.85 24.64,16.36 25.38,17.09 C462.1 | v25.09,8.23 25.09,8.89 25.6,9.4 | U401.59 30.73,13.74 30.73,16.59 v30.25,17.07 29.97,17.35 29.97,18.8 29.49,19.28 | 26.82,17.3 26.82,17.17 C462.1 | C462.1 25.35,17.2 C701.2 22.55,19.89 20.42,19.89 18.62,18.09 | 26.87,17.37 26.87,18.14 C461.1 27.58,18.85 27.58,19.48 29.29,19.48 29.49,19.28 | 26.9,17.27 27.69,16.48 28.27,16.48 29.03,15.72 Y401.2 | 18.62,18.09 18.62,16.46 18.16,16 U701.6 | 12.01,18.14 18.57,18.14 18.62,18.09 | 34.87,19.38 34.82,19.33 29.54,19.33 29.49,19.28 | 39.6,19.56 v39.85,19.3
  Bottom 0.152: v50.9,19.48 C301.2 | v40.87,15.24 41.2,15.57 41.6,15.57 43.13,17.09 43.46,17.09 v43.51,17.14 43.79,17.42 44.98,17.42 U201.8 45.06,17.45 U201.7 45.72,17.45 46.28,17.45 U201.6 46.35,17.45 U201.5 47.02,17.48 v47.6,17.48 48.64,17.48 | v50.04,18.01 49.78,17.75 48.92,17.75 48.64,17.48 | J301.1 50.16,16.26 49.02,16.26 48.69,16.59 48.69,17.42 48.64,17.48 | 47.4,10.62 49.2,10.62 49.78,11.2 U301.2 49.61,10.92 v50.22,10.31 50.29,10.24 53.29,10.24 53.98,10.92 C302.2 | 47.4,10.62 46.43,10.62 C204.2 | v50.19,7.82 R301.1 | C201.2 46.86,3.56 48.13,4.83 C203.2 47.88,4.47 v48.54,3.81 | v47.4,11.1 47.4,10.62 | v28.75,3.83 28.04,3.12 22.94,3.12 22.28,3.79 C020.2 21.46,3.07 12.22,3.07 J401.2 8.74,2.44 3.33,2.44 v2.06,1.17 | v25.04,9.96 24.49,9.96 C030.2 | C010.2 22.23,9.14 22.86,8.51 v22.86,8.28 22.91,8.23 22.91,6.83 23.06,6.68 23.95,6.68 24,6.73 25.68,6.73 25.68,7.64 v25.09,8.23 | v24.36,12.57 23.65,12.57 R031.1 | v30.25,17.07 29.01,17.07 29.01,18.64 U$1.5 | v42.06,19.25 42.01,19.3 v39.85,19.3
GYROINT  (via drill 0.33)
  Top 0.152: v43.31,10.62 45.03,10.62 45.19,10.77 45.19,11.15 U501.6 | v38.91,10.62 38.63,10.9 37.62,10.9 U401.46
  Bottom 0.152: v38.91,10.62 v43.31,10.62
MISO0  (1 unrouted)
MISO1  (via drill 0.33)
  Top 0.152: v41.17,12.22 43.87,12.22 U501.4 | v39.34,11.99 38.71,12.62 38.71,16.69 39.4,17.37 39.85,17.37 | 39.85,17.37 40.06,17.37 40.06,18.19 U601.12 | v33.81,17.07 33.81,13.79 U401.53 | v39.85,17.09 39.85,17.37
  Bottom 0.152: v41.17,12.22 40.95,11.99 v39.34,11.99 | v33.81,17.07 33.88,17.14 39.8,17.14 v39.85,17.09
MOSI0  (1 unrouted)
MOSI1  (via drill 0.33)
  Top 0.152: 46.71,20.4 45.34,19.02 45.34,18.03 45.24,17.93 U502.1 | 46.71,20.4 U502.5 | v33.25,5.82 33.25,13.72 U401.54 | v51.03,6.33 52.12,7.42 52.12,17.22 v51.33,18.01 | v48.44,18.09 48.44,19.48 47.57,20.34 46.76,20.34 46.71,20.4
  Bottom 0.152: v33.25,5.82 47.42,5.82 47.52,5.92 50.62,5.92 v51.03,6.33 | v51.33,18.01 50.75,18.59 49.81,18.59 49.3,18.09 v48.44,18.09
N$1
  Top 0.152: C504.2 50.67,12.95 50.29,12.57 50.29,12.29 47.93,9.93 47.47,9.93 R001.8
N$2
  Bottom 0.152: R301.2 48.9,6.6 49.45,7.16 49.45,8.46 49.23,8.46 48.84,8.84 U301.5
N$4
  Bottom 0.152: D301.C 48.82,12.42 48.82,11.48 U301.1
N$5
  Bottom 0.152: D301.A R302.1
N$6  (via drill 0.33)
  Top 0.152: v39.29,13.64 v39.29,16.46 | v29.92,12.42 31.17,11.18 v31.17,7.29 | v35.03,6.4 v35.03,11.15
  Bottom 0.152: v39.29,16.46 38.15,16.46 D000.A | v39.29,13.64 38.68,13.03 38.35,13.03 Q000.2 38.51,12.98 37.9,12.37 36.25,12.37 v35.03,11.15 | v29.92,12.42 28.65,13.69 24.31,13.69 R011.1 | v31.17,7.29 32.05,6.4 v35.03,6.4
N$7  (via drill 0.33)
  Top 0.152: v53.11,18.9 53.11,6.76 48.59,2.23 47.83,2.23 46.84,3.23 46.33,3.23 46.33,5.79 45.77,6.35 45.52,6.35 R402.5
  Bottom 0.152: v53.11,18.9 49.68,18.9 49.45,18.67 44.22,18.67 41.43,15.88 37.24,15.88 D000.C
N$11
  Top 0.152: R402.7 45.49,4.7 43.59,4.7 D401.5
N$12
  Top 0.152: R402.6 45.49,5.49 43.59,5.49 43.59,5.77 D401.6
N$13
  Top 0.152: R402.8 45.49,3.81 43.59,3.81 43.59,3.86 D401.4
N$14
  Top 0.152: U801.8 5.69,17.27 6.58,17.27 6.58,21.36 6.12,21.82 3.05,21.82 C808.1
N$15
  Top 0.152: U801.12 3.56,17.88 3.38,18.06 3.38,19.58 C808.2
N$16
  Top 0.152: U801.10 4.7,18.01 4.7,19.02 C810.1
N$17  (via drill 0.33)
  Top 0.152: v51.87,6.33 52.81,7.26 52.81,18.39 v49.68,21.51
  Bottom 0.152: v51.87,6.33 51.16,5.61 47.65,5.61 46.86,4.83 C203.1 | v49.68,21.51 49.38,21.82 47.09,21.82 46.97,21.69 U201.4
N$20  (via drill 0.33)
  Top 0.152: C504.1 49.4,12.95 49.4,14.48 C503.1 49.33,14.5 v48.62,15.21 | v46.15,16.08 46.15,15.16 U501.14
  Bottom 0.152: v46.15,16.08 47.02,15.21 v48.62,15.21
PWMB  (via drill 0.33)
  Top 0.152: v28.07,11.99 28.07,11.89 26.42,11.89 U401.1 | v34.42,9.98 v34.42,6.99 34.37,6.93 34.37,5.23 33.15,5.23 v32.33,4.42 | v39.5,6.63 40.23,5.89 40.23,5.79 D401.1
  Bottom 0.152: v28.07,11.99 28.19,12.12 29.41,12.12 29.69,11.84 32.56,11.84 v34.42,9.98 | v34.42,6.99 38.43,6.99 38.79,6.63 v39.5,6.63 | J402.3 45.57,2.82 42.85,2.82 42.42,3.25 31.5,3.25 31.14,3.61 31.14,4.42 v32.33,4.42
PWMG
  Top 0.152: 40.23,2.08 39.42,2.08 38.86,2.64 38.86,3.12 37.62,4.37 U401.33 | 40.23,2.08 40.23,3.86 D401.3 | J402.1 40.92,1.4 40.23,2.08
PWMR  (via drill 0.33)
  Top 0.152: 39.17,4.88 40.23,4.88 D401.2 | 39.17,4.88 37.62,4.88 U401.34 | v39.65,2.67 39.17,3.15 39.17,4.88
  Bottom 0.152: v39.65,2.67 39.75,2.56 42.67,2.56 44.09,1.14 J402.2
RAW  (via drill 0.33)
  Top 0.152: v56.29,5.71 56.29,10.26 v54.41,12.14 54.36,12.19 54.36,22.1 45.34,22.1 44.93,21.69 v44.35,21.69
  Bottom 0.152: U201.2 45.64,21.69 45.01,21.69 U201.1 44.93,21.69 v44.35,21.69 | v54.41,12.14 52.65,13.89 47.37,13.89 47.37,12.95 45.09,10.67 C204.1 | v56.29,5.71 S201.2
RX0  (via drill 0.33)
  Top 0.152: v28.47,10.77 30.71,8.53 30.71,8.05 30.25,7.59 U401.21 | v19.33,11.61 15.24,7.52 J401.4
  Bottom 0.152: v28.47,10.77 27.25,11.99 21.72,11.99 21.36,12.34 20.07,12.34 v19.33,11.61
SCK0  (via drill 0.51)
  Top 0.152: U401.27 33.25,4.32 v33.27,4.32 | v21.08,11.68 20.83,11.94 19.81,11.94 17.05,14.7 U701.5
  Bottom 0.152: v21.08,11.68 25.91,11.68 v33.27,4.32
SCK1  (via drill 0.33)
  Top 0.152: 41.45,13.49 42.9,13.49 42.93,13.51 43.87,13.51 U501.2 | 41.45,13.49 41.45,18.82 U601.14 | v39.95,12.57 39.95,11.38 37.62,11.38 U401.47 | v41.4,13.28 41.4,13.44 41.45,13.49
  Bottom 0.152: v39.95,12.57 40.01,12.62 40.74,12.62 v41.4,13.28
SCL0  (via drill 0.33)
  Top 0.152: v30.84,5.31 30.76,5.23 U401.22 | R401.2 25.09,1.91 24.28,1.91 v24.28,4.55 21.92,6.91 v21.36,6.91 | 3.56,8.03 2.46,9.12 2.46,12.32 3.38,13.23 3.38,14.96 3.56,15.14 U801.1 | U101.6 3.56,8.03 | 3.56,8.03 v3.61,7.98
  Bottom 0.152: v24.28,4.55 24.99,5.26 30.79,5.26 v30.84,5.31 | v21.36,6.91 4.67,6.91 v3.61,7.98
SCL1  (via drill 0.33)
  Top 0.152: v26.77,2.18 26.77,0.99 25.12,0.99 R401.1 | v38.91,7.32 38.91,6.4 37.62,6.4 U401.37 | v32.66,6.99 31.67,5.99 v31.67,5.11
  Bottom 0.152: J401.5 18.77,2.26 26.7,2.26 v26.77,2.18 26.75,2.31 30.18,2.31 30.18,4.29 30.61,4.72 31.29,4.72 v31.67,5.11 | v38.91,7.32 38.66,7.57 33.25,7.57 v32.66,6.99
SDA0  (via drill 0.33)
  Top 0.152: v26.19,1.57 26.19,2.67 25.12,2.67 R401.3 | v32.99,1.22 32.77,1.45 32.77,2.52 U401.26 | 2.16,8.56 2.16,6.78 2.29,6.66 U101.7 | 2.16,8.56 2.16,15.75 2.95,15.75 U801.16 | v21.69,1.68 21.34,1.68 16.03,6.99 v16.03,7.49 | 2.16,8.56 v2.21,8.56
  Bottom 0.152: v32.99,1.22 32.66,1.55 26.21,1.55 v26.19,1.57 26.09,1.68 v21.69,1.68 | v16.03,7.49 15.75,7.21 5.18,7.21 3.83,8.56 v2.21,8.56
SDA1  (via drill 0.33)
  Top 0.152: v27.36,0.96 27.36,3.56 25.12,3.56 R401.4 | v36.78,2.67 36.55,2.9 36.55,8.36 37.59,8.36 U401.41
  Bottom 0.152: J401.6 20.34,0.99 27.33,0.99 v27.36,0.96 27.69,0.64 34.75,0.64 v36.78,2.67
TX0  (via drill 0.33)
  Top 0.152: v29.59,3.83 29.36,3.61 29.36,2.64 U401.19
  Bottom 0.152: v29.59,3.83 28.52,2.77 14.2,2.77 J401.3
USB_LIGHT  (via drill 0.33)
  Top 0.152: v40.51,13.21 40.59,13.13 v40.59,8.51 | v43.38,7.59 44.68,7.59 44.68,7.75 45.16,8.23 45.49,8.23 R001.3 | v29.54,8.89 28.73,8.08 28.73,6.38 28.17,5.82 28.17,2.62 U401.17
  Bottom 0.152: v40.51,13.21 40.51,13.23 39.52,14.22 39.04,14.22 38.35,14.91 Q000.1 | v40.59,8.51 41.96,8.51 42.88,7.59 v43.38,7.59 43.41,7.64 43.41,8.69 42.7,9.4 30.05,9.4 v29.54,8.89
USB_ON  (1 unrouted)
USBD+  (via drill 0.33)
  Top 0.152: v25.09,7.39 U401.10
  Bottom 0.152: C010.1 R010.1 23.57,7.39 v25.09,7.39
USBD-  (via drill 0.33)
  Top 0.152: v27.71,6.6 27.46,6.6 27.2,6.86 26.42,6.86 U401.11
  Bottom 0.152: C020.1 R020.1 23.57,5.56 26.67,5.56 v27.71,6.6
VBUS  (via drill 0.33)
  Top 0.152: 48.87,9.04 v49.63,9.04 49.63,10.9 v51.51,10.9 | 48.87,9.04 47.47,9.04 R001.7 | v30.73,17.78 31.22,17.3 31.22,15.49 v31.67,15.04 | v43.99,8.18 42.82,8.18 v42.82,8.46 | v33.83,12.42 v33.83,8.81 | v48.87,7.75 48.87,9.04
  Bottom 0.152: 52.22,10.92 52.22,13.21 R302.2 | 52.22,10.92 C302.1 | v49.63,9.04 49.81,8.87 U301.4 | v51.51,10.9 52.17,10.9 52.22,10.92 | 21.01,12.7 18.75,12.7 18.75,11.38 19.1,11.02 22.1,11.02 C030.1 | 21.01,12.7 R031.2 | 21.01,12.7 21.01,14.4 21.77,15.16 23.95,15.16 24.92,14.2 29.26,14.2 30.79,15.72 D302.1 30.86,15.7 31.01,15.7 v31.67,15.04 31.73,14.99 32.38,14.99 32.38,13.87 v33.83,12.42 | v30.73,17.78 29.84,17.78 29.84,19.02 29.29,19.58 26.39,19.58 U$1.1 | v48.87,7.75 48.59,8.03 44.15,8.03 v43.99,8.18 | v42.82,8.46 42.19,9.09 34.11,9.09 v33.83,8.81
VCC  (via drill 0.33)
  Top 0.152: R401.8 23.16,1.02 23.16,1.88 R401.7 23.16,1.96 23.16,2.67 R401.6 23.16,2.74 23.16,3.56 R401.5 23.09,3.61 20.17,3.61 v20.17,3.66 | v9.73,3.38 J401.1 5.59,3.3 | 22.07,17.8 22.07,17.58 v21.54,17.04 | 22.07,17.8 22.07,18.11 C701.1 | v16.82,17.04 15.95,16.18 15.95,16 U701.4 | C101.1 4.83,1.63 U101.3 4.85,2.56 5.59,3.3 | 1.52,17.27 2.95,17.27 U801.13 | 1.52,17.27 C802.1 | 4.29,14.61 4.32,14.58 5.05,14.58 | 4.29,14.61 4.19,14.71 4.19,15.04 4.09,15.14 U801.2 | 5.05,14.58 5.05,15.14 U801.4 | 5.05,14.58 7.87,11.76 7.87,6.81 5.64,4.57 U101.4 5.59,4.52 5.59,3.3 | v1.52,15.62 1.52,17.27 | 4.29,14.61 v3.99,14.3 | C606.1 35.56,19.96 36.85,19.96 U601.6 36.85,20.47 v36.85,21.51 | U601.1 40.84,20.42 40.84,21.77 40.77,21.84 C601.1 40.79,21.51 v39.9,21.51 | U501.15 44.76,15.06 U501.16 44.73,14.99 44.63,14.88 44.63,14.78 44.04,14.2 43.94,14.2 U501.1 43.87,14.2 43.46,14.61 | 44.5,20.4 44.09,19.99 44.09,15.88 43.46,15.24 43.46,14.61 | 44.5,20.4 U502.8 | C502.1 43.41,14.22 43.41,14.55 43.46,14.61 | v44.09,20.8 44.5,20.4 | C407.1 26.39,10.92 26.39,10.9 U401.3 26.47,10.85 27.23,10.85 27.46,10.62 | 27.46,10.62 27.46,8.89 26.42,8.89 U401.7 | 28.65,11.76 28.65,13.61 28.75,13.72 U401.63 | 28.65,11.76 27.51,10.62 27.46,10.62 | v28.91,11.53 28.7,11.73 28.65,11.76 | U401.57 31.75,13.72 v31.75,11.25 32.66,10.34 v32.66,8.81 | C443.1 38.63,9.78 38.63,9.63 38.41,9.4 37.62,9.4 U401.43 37.54,9.4 35.74,9.4 | 35.74,14.94 35.74,13.74 U401.49 35.69,13.69 35.69,12.68 | 35.74,14.94 35.74,15.34 C451.1 | 35.74,14.94 v36.22,14.94 | 35.69,12.68 35.03,12.68 34.87,12.83 34.87,13.61 34.77,13.72 U401.51 | 35.74,9.4 35.74,12.62 35.69,12.68
  Top 0.152: C423.1 30.86,1.02 31.24,1.4 31.24,2.52 U401.23 31.29,2.59 31.37,2.67 31.37,3.48 v31.73,3.83 | v48.36,2.82 49.12,3.58 49.12,6.68 48.28,7.52 48.28,7.75 47.83,8.2 47.52,8.2 R001.6 47.45,8.26 47.12,8.26 46.63,8.74 46.63,10.49 48.06,10.49 49.99,12.42 49.99,15.42 49.4,16 C501.1 49.35,16.05 49.35,19.38 v48.31,20.42 | v35.61,3.83 v35.61,8.46 35.61,9.27 35.74,9.4 | 22.07,17.8 v22.4,17.8
  Bottom 0.152: v20.17,3.66 19.89,3.38 v9.73,3.38 | v21.54,17.04 v16.82,17.04 14.12,14.35 4.04,14.35 v3.99,14.3 2.85,14.3 v1.52,15.62 | 46.28,20.8 46.28,21.67 U201.3 | 46.28,20.8 v44.09,20.8 43.89,21.01 40.41,21.01 v39.9,21.51 v36.85,21.51 35.48,20.14 23.44,20.14 23.44,18.85 v22.4,17.8 | v31.75,11.25 31.47,11.53 v28.91,11.53 | v36.22,14.94 36.22,13.97 Q000.3 | v48.36,2.82 46.18,2.82 45.87,3.12 45.57,3.12 45.14,3.56 C201.1 45.06,3.58 35.61,3.58 | v31.73,3.83 31.98,3.58 35.61,3.58 | 35.61,3.58 v35.61,3.83 | v32.66,8.81 33.25,8.23 35.38,8.23 v35.61,8.46 | v48.31,20.42 46.66,20.42 46.28,20.8
VIN
  Bottom 0.152: D302.3 31.75,13.61 35.66,9.7 54.81,9.7 S201.3
VLIPO  (via drill 0.33)
  Top 0.152: v51.54,16 v51.54,12.27 | v31.8,15.9 32.56,16.66 v32.56,17.5 | v42.65,20.42 43.76,21.54 43.76,21.92 44.25,22.4 54.94,22.4 v54.94,22.12
  Bottom 0.152: v51.54,12.27 50.75,11.48 U301.3 | v51.54,16 51.54,16.99 51.44,16.99 J301.2 51.59,17.04 52.86,18.31 53.34,18.31 53.7,18.67 53.7,21.08 | v31.8,15.9 32.54,15.9 32.69,15.75 D302.2 | v32.56,17.5 34.9,19.84 37.59,19.84 38.18,20.42 v42.65,20.42 | v54.94,22.12 53.9,21.08 53.7,21.08 | 53.7,21.08 C301.1
XCLR  (via drill 0.33)
  Top 0.152: v24.71,6.15 24.71,5.89 26.39,5.89 U401.13 | v1.5,5.49 1.91,5.08 U101.8
  Bottom 0.152: v24.71,6.15 24.54,6.33 2.34,6.33 v1.5,5.49
XTAL1
  Top 0.152: C462.2 26.82,15.85 26.82,15.72 Y401.1 26.87,15.65 26.87,14.88 28.88,14.88 29.13,14.63 29.13,13.84 29.23,13.74 U401.62
XTAL2
  Top 0.152: C461.2 28.85,18.8 29.03,18.62 Y401.3 29.11,17.27 29.97,16.41 29.97,15.04 29.87,14.94 29.87,13.84 29.77,13.74 U401.61

### Text on the board
tPlace: ON | BSL | VCC | GND | TX0 | RX0 | SCL | SDA | RGB | PWM
bPlace: VCC | GND | TX0 | RX0 | SCL | SDA | + | - | Kwan Systems | a division of | the Terminally ADD | St Kwan's Home for | 29 Aug 2011 | Stick IMUinator v1.3 | Project Candace
tDocu: BYP 4 | 3 EN | VOUT 5 | 1 VIN | 2 GND | 7 SDA | 6 SCL | 5 NC | 8 XCLR | 4 VDD | 1 GND | 2 EOC | 3 VDDA
bDocu: 5 PROG | STAT 1 | VBAT 3 | VSS 2 | 4 VDD | VBus | D+ | D- | NC | GND